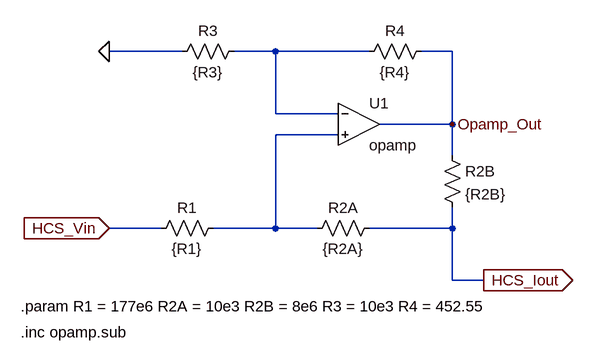
[diagram p0: schematic HCS_model.asc]
HCS_model.asc, the LTspice schematic file:
Version 4
SHEET 1 880 680
WIRE -96 80 -208 80
WIRE 48 80 -16 80
WIRE 192 80 48 80
WIRE 320 80 272 80
WIRE 48 176 48 80
WIRE 144 176 48 176
WIRE 320 192 320 80
WIRE 320 192 208 192
WIRE 144 208 48 208
WIRE 320 240 320 192
WIRE -128 352 -208 352
WIRE 48 352 48 208
WIRE 48 352 -48 352
WIRE 112 352 48 352
WIRE 320 352 320 320
WIRE 320 352 192 352
WIRE 320 432 320 352
WIRE 368 432 320 432
FLAG -208 80 0
FLAG -208 352 HCS_Vin
IOPIN -208 352 In
FLAG 368 432 HCS_Iout
IOPIN 368 432 Out
FLAG 320 192 Opamp_Out
SYMBOL OpAmps\\opamp 176 128 R0
SYMATTR InstName U1
SYMATTR SpiceLine2 GBW=110Meg
SYMBOL res 304 224 R0
SYMATTR InstName R2B
SYMATTR Value {R2B}
SYMBOL res 208 336 R90
WINDOW 0 0 56 VBottom 2
WINDOW 3 32 56 VTop 2
SYMATTR InstName R2A
SYMATTR Value {R2A}
SYMBOL res 288 64 R90
WINDOW 0 0 56 VBottom 2
WINDOW 3 32 56 VTop 2
SYMATTR InstName R4
SYMATTR Value {R4}
SYMBOL res 0 64 R90
WINDOW 0 0 56 VBottom 2
WINDOW 3 32 56 VTop 2
SYMATTR InstName R3
SYMATTR Value {R3}
SYMBOL res -32 336 R90
WINDOW 0 0 56 VBottom 2
WINDOW 3 32 56 VTop 2
SYMATTR InstName R1
SYMATTR Value {R1}
TEXT -344 472 Left 2 !.param R1 = 177e6 R2A = 10e3 R2B = 8e6 R3 = 10e3 R4 = 452.55
TEXT -344 512 Left 2 !.inc opamp.sub

The netlist it stands for:
* HCS_model.asc
XU1 N001 N002 Opamp_Out opamp Aol=100K GBW=110Meg  ; pins invin noninvin out
R2B Opamp_Out HCS_Iout {R2B}
R2A HCS_Iout N002 {R2A}
R4 Opamp_Out N001 {R4}
R3 N001 0 {R3}
R1 N002 HCS_Vin {R1}
.param R1 = 177e6 R2A = 10e3 R2B = 8e6 R3 = 10e3 R4 = 452.55
.inc opamp.sub
.backanno
.end